# Altium schematic sheet Wifi.SchDoc
size A4
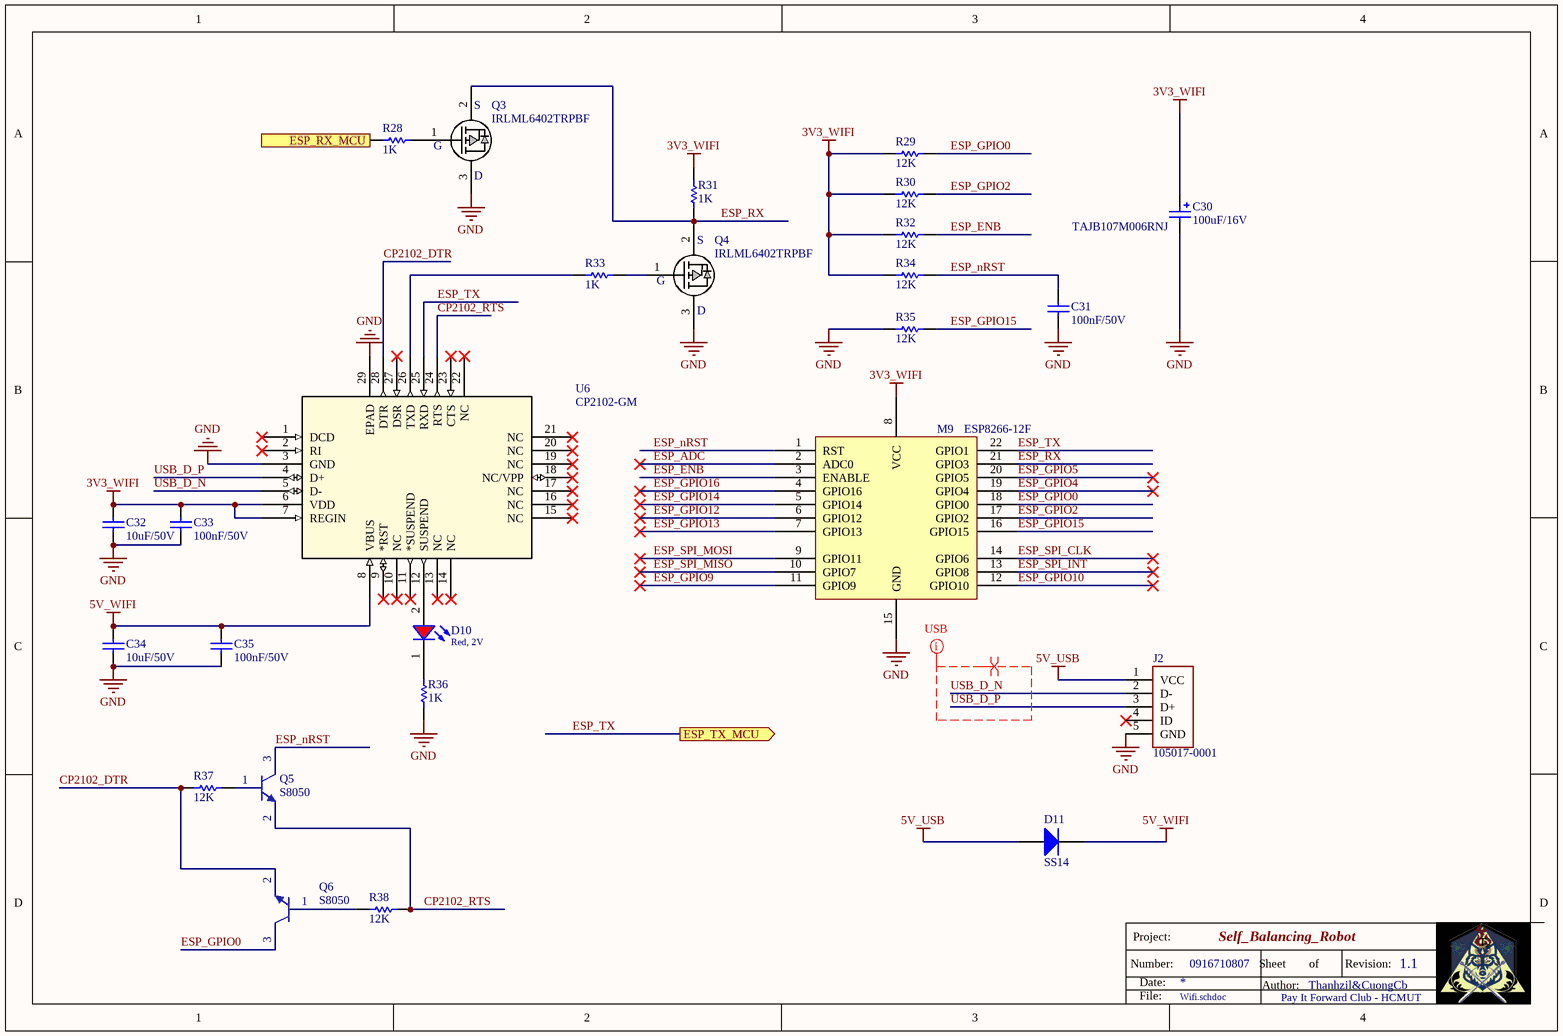
[diagram p0: Wifi.SchDoc]

## Parts
C30  value 100uF/16V  [CAP_SM_TAN]  (hidden comment: TAJB107M006RNJ)
C31  value 100nF/50V  [CAP-SM-0805]  (hidden comment: Cap-100nF-50V-0805)
C32  value 10uF/50V  [CAP-SM-0805]  (hidden comment: Cap-10uF-50V-0805)
C33  value 100nF/50V  [CAP-SM-0805]  (hidden comment: Cap-100nF-50V-0805)
C34  value 10uF/50V  [CAP-SM-0805]  (hidden comment: Cap-10uF-50V-0805)
C35  value 100nF/50V  [CAP-SM-0805]  (hidden comment: Cap-100nF-50V-0805)
D10  Red, 2V  [WL-SMCW_0805]
D11  SS14  [SS14]
J2  105017-0001  [CONN_105017-0001]
M9  ESP8266-12F  [ESP8266-12F]
Q3  IRLML6402TRPBF  [SOT23_NEX]
Q4  IRLML6402TRPBF  [SOT23_NEX]
Q5  S8050  [SOT23_NEX]
Q6  S8050  [SOT23_NEX]
R28  value 1K  [RES-SM-0805]  (hidden comment: Res-1K-0805)
R29  value 12K  [RES-SM-0805]  (hidden comment: Res-12K-0805)
R30  value 12K  [RES-SM-0805]  (hidden comment: Res-12K-0805)
R31  value 1K  [RES-SM-0805]  (hidden comment: Res-1K-0805)
R32  value 12K  [RES-SM-0805]  (hidden comment: Res-12K-0805)
R33  value 1K  [RES-SM-0805]  (hidden comment: Res-1K-0805)
R34  value 12K  [RES-SM-0805]  (hidden comment: Res-12K-0805)
R35  value 12K  [RES-SM-0805]  (hidden comment: Res-12K-0805)
R36  value 1K  [RES-SM-0805]  (hidden comment: Res-1K-0805)
R37  value 12K  [RES-SM-0805]  (hidden comment: Res-12K-0805)
R38  value 12K  [RES-SM-0805]  (hidden comment: Res-12K-0805)
U6  CP2102-GM  [CP2102-GM]

## Ports
ESP_RX_MCU (in), ESP_TX_MCU (out)

## Nets
3V3_WIFI: C30.1 C32.1 C33.2 M9.8(VCC) R29.1 R30.1 R31.2 R32.1 R34.1 U6.6(VDD) U6.7(REGIN)
5V_USB: D11.2(A) J2.1(VCC)
5V_WIFI: C34.2 C35.2 D11.1(K) U6.8(VBUS)
GND: C30.2 C31.1 C32.2 C33.1 C34.1 C35.1 J2.5(GND) M9.15(GND) Q3.3(D) Q4.3(D) R35.1 R36.1 U6.3(GND) U6.29(EPAD)
CP2102_DTR: Q6.2(E) R37.1 U6.28(DTR)
CP2102_RTS: Q5.2(E) R38.2 U6.24(RTS)
ESP_ADC: M9.2(ADC0)
ESP_ENB: M9.3(ENABLE) R32.2
ESP_GPIO0: M9.18(GPIO0) Q6.3(C) R29.2
ESP_GPIO2: M9.17(GPIO2) R30.2
ESP_GPIO4: M9.19(GPIO4)
ESP_GPIO5: M9.20(GPIO5)
ESP_GPIO9: M9.11(GPIO9)
ESP_GPIO10: M9.12(GPIO10)
ESP_GPIO12: M9.6(GPIO12)
ESP_GPIO13: M9.7(GPIO13)
ESP_GPIO14: M9.5(GPIO14)
ESP_GPIO15: M9.16(GPIO15) R35.2
ESP_GPIO16: M9.4(GPIO16)
ESP_nRST: C31.2 M9.1(RST) Q5.3(C) R34.2
ESP_RX: M9.21(GPIO3) Q3.2(S) Q4.2(S) R31.1
ESP_RX_MCU: R28.1 ; port ESP_RX_MCU
ESP_SPI_CLK: M9.14(GPIO6)
ESP_SPI_INT: M9.13(GPIO8)
ESP_SPI_MISO: M9.10(GPIO7)
ESP_SPI_MOSI: M9.9(GPIO11)
ESP_TX: M9.22(GPIO1) U6.25(RXD) ; port ESP_TX_MCU
USB_D_N: J2.2(D-) U6.5(D-)
USB_D_P: J2.3(D+) U6.4(D+)
NetD10_1: D10.1(K) R36.2
NetD10_2: D10.2(A) U6.12(SUSPEND)
NetQ3_1: Q3.1(G) R28.2
NetQ4_1: Q4.1(G) R33.1
NetQ5_1: Q5.1(B) R37.2
NetQ6_1: Q6.1(B) R38.1
NetR33_2: R33.2 U6.26(TXD)

Not connected (* = marked no-connect by the designer): J2 4(ID)*; U6 1(DCD)* 2(RI)* 9(*RST)* 10(NC)* 11(*SUSPEND)* 13(NC)* 14(NC)* 15(NC)* 16(NC)* 17(NC)* 18(NC/VPP)* 19(NC)* 20(NC)* 21(NC)* 22(NC)* 23(CTS)* 27(DSR)*

## Layout directives
differential pair: USB_D_N, USB_D_P
mark named USB: USB_D_N, USB_D_P

## Notes on the sheet
- (near C30) TAJB107M006RNJ
- Date:
- Project:
- Number:
- 0916710807
- Self_Balancing_Robot
- Sheet
- Author:
- of
- Revision:
- 1.1
- Thanhzil&CuongCb
- Pay It Forward Club - HCMUT
- File:
- Wifi.schdoc

## Library data of the parts
C30 = Cap-Tan-100uF-16V: Manufacturer: Nichicon; Manufacturer Part Number: UWX1C101MCL1GB; Local Supplier: icdayroi; Local Supplier Link: https://icdayroi.com/tu-tantalum-100uf-16v-smd6032; Supplier 1: Digikey; Supplier 1 Part Number: 493-2105-1-ND; Supplier 1 Link: https://www.digikey.com/product-detail/en/nichicon/UWX1C101MCL1GB/493-2105-1-ND/590080
C31 C33 C35 = Cap-100nF-50V-0805: CAP CER 0.1UF 50V Y5V 0805; Manufacturer: Samsung Electro-Mechanics; Manufacturer Part Number: CL21F104ZBCNNNC; Local Supplier: thegioiic; Local Supplier Link: https://thegioiic.com/products/tu-100nf-0-1uf-50v-0805; Supplier 1: Digikey; Supplier 1 Part Number: 1276-1007-1-ND; Supplier 1 Link: https://www.digikey.com/product-detail/en/samsung-electro-mechanics/CL21F104ZBCNNNC/1276-1007-1-ND/3889093
C32 C34 = Cap-10uF-50V-0805: CAP CER 10UF 50V X5R 0805; Manufacturer: Yageo; Manufacturer Part Number: CC0805KKX5R9BB106; Local Supplier: thegioiic; Local Supplier Link: https://thegioiic.com/products/tu-10uf-50v-0805; Supplier 1: Digikey; Supplier 1 Link: https://www.digikey.com/product-detail/en/yageo/CC0805KKX5R9BB106/311-3499-2-ND/7164383; Supplier 1 Part Number: 311-3499-2-ND
D10 = 150080RS75000: WL-SMCW SMT Mono-color Chip LED Waterclear, size 0805, Red, 2V, 140deg; Chip Technology: AlInGaP; Dominant Wavelength typ.: 625nm; Luminous Intensity typ.: 150mcd; Peak Wavelength typ.: 630nm; Viewing Angle: 140deg; ComponentLink1Description: Manufacturer; ComponentLink1URL: http://www.we-online.de; ComponentLink2URL: https://www.we-online.com/catalog/datasheet/150080RS75000.pdf; ComponentLink2Description: Datasheet; Forward Voltage typ.: 2V; Emitting Color: Red; Mounting Technology: SMT; Operating Temperature: -40 to +85degC; Published Date: December 2019; Part Number: 150080RS75000; Packaging: Tape and Reel; Size: 0805; Publisher: Wurth Elektronik
D11 = Diode-SS14: DIODE SCHOTTKY 40V 1A SMA; Manufacturer: ON Semiconductor; Local Supplier: thegioiic; Local Supplier Link: https://thegioiic.com/products/ss14-sma; Supplier 1: Digikey; Supplier 1 Link: https://www.digikey.com/product-detail/en/on-semiconductor/SS14/SS14CT-ND/965729; Manufacturer Part Number: SS14; Supplier 1 Part Number: SS14CT-ND
J2 = 105017-0001: No Description Available; Vendor: Molex Connector Corporation; Built_By: EMA_Cory; SourceLibrary: Molex_2020-05-26; Datasheet: https://www.molex.com/pdm_docs/sd/1050170001_sd.pdf; Manufacturer_Part_Number: 105017-0001; Copyright: Copyright (C) 2018 Accelerated Designs. All rights reserved; RefDes: RefDes; Type: DEV
Q3 Q4 = IRLML6402TRPBF: P-Channel 20V 3.7A (Ta) 1.3W (Ta) Surface Mount Micro3™/SOT-23
R28 R31 R33 R36 = Res-1K-0805: RES 1K OHM 1% 1/4W 0805; Manufacturer: Stackpole Electronics Inc; Manufacturer Part Number: RNCP0805FTD1K00; Local Supplier: thegioiic; Local Supplier Link: https://thegioiic.com/products/dien-tro-1k-ohm-0805-5; Supplier 1: Digikey; Supplier 1 Link: https://www.digikey.com/product-detail/en/stackpole-electronics-inc/RNCP0805FTD1K00/RNCP0805FTD1K00CT-ND/2240568; Supplier 1 Part Number: RNCP0805FTD1K00CT-ND
R29 R30 R32 R34 R35 R37 R38 = Res-12K-0805: RES 12 KOHM JUMPER 0805; Manufacturer: Vishay Thin Film; Manufacturer Part Number: PAT0805E3121BST1; Local Supplier: icdayroi; Local Supplier Link: https://icdayroi.com/dien-tro-12k-0805-1-goi-50-con; Supplier 1: Digikey; Supplier 1 Link: https://www.digikey.com/product-detail/en/vishay-thin-film/PAT0805E3121BST1/PAT0805E3121BST1-ND/2281536; Supplier 1 Part Number: PAT0805E3121BST1-ND
U6 = CP2102-GM: Vendor: Silicon Labs; Built_By: EMA_UL_Team; SourceLibrary: Silicon_Labs_2015-03-23; Manufacturer_Part_Number: CP2102-GM; Copyright: Copyright (C) 2018 Accelerated Designs. All rights reserved; RefDes: RefDes; Type: DEV
M9 = ESP8266-12F: Local Supplier: HShop; Local Supplier Link: https://hshop.vn/products/mach-thu-phat-wifi-soc-esp8266-v12; Local Supplier Link Part Number: HS000912; Manufacturer: *; Manufacturer Part Number: *